# EAGLE design CarteCapteur2 (EAGLE 5.00)
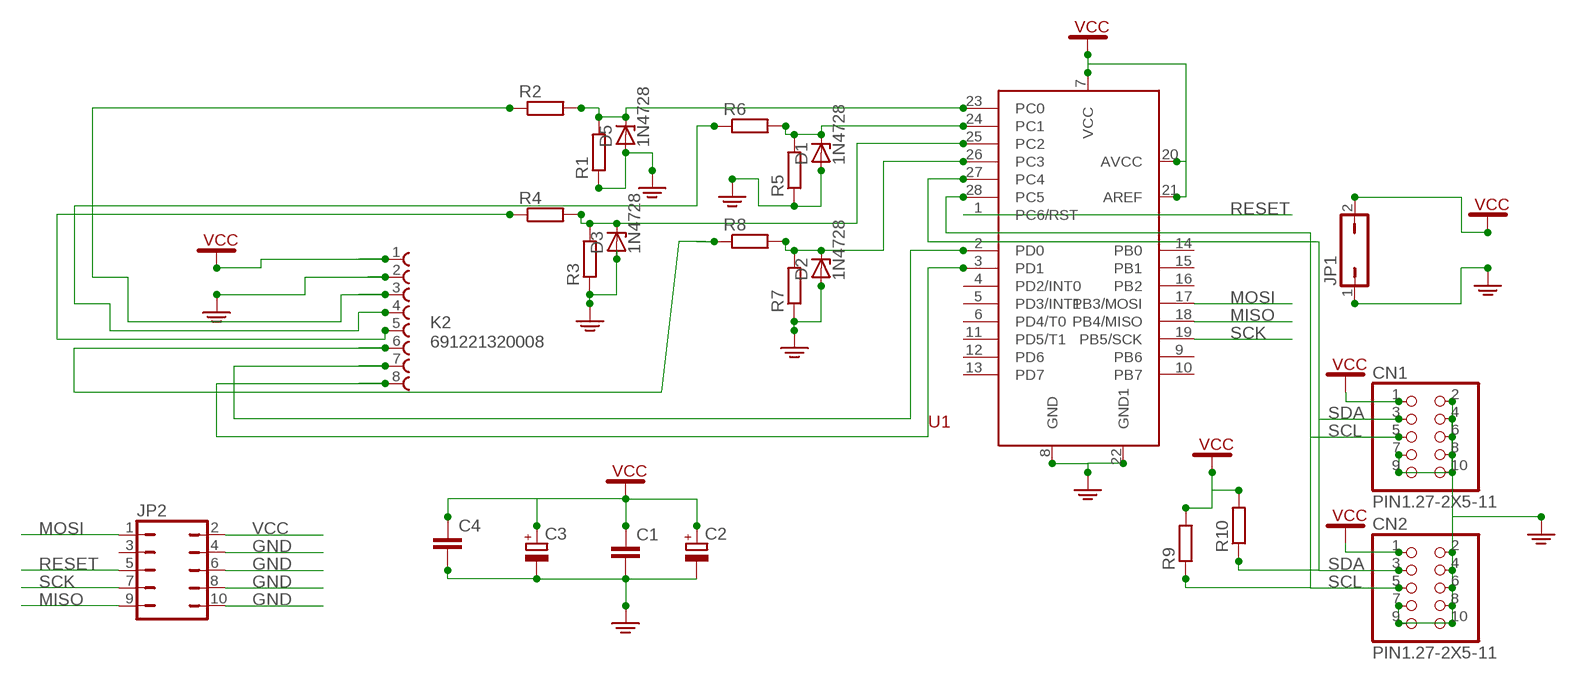
[diagram p0: schematic, sheet 1]

## Parts
C1  C-EU050-025X075  [C050-025X075]
C2  CPOL-EUE5-6  [E5-6]
C3  CPOL-EUE5-6  [E5-6]
C4  C-EU050-025X075  [C050-025X075]
CN1  PIN1.27-2X5-11  [2X05-TH1.27MM-LC]
CN2  PIN1.27-2X5-11  [2X05-TH1.27MM-LC]
D1  1N4728  [DO41Z10]
D2  1N4728  [DO41Z10]
D3  1N4728  [DO41Z10]
D5  1N4728  [DO41Z10]
JP1  JP1Q  [JP1]
JP2  JP5Q  [JP5Q]
K2  691221320008  [691221320008]
R1  R-EU_0207/10  [0207/10]
R2  R-EU_0207/10  [0207/10]
R3  R-EU_0207/10  [0207/10]
R4  R-EU_0207/10  [0207/10]
R5  R-EU_0207/10  [0207/10]
R6  R-EU_0207/10  [0207/10]
R7  R-EU_0207/10  [0207/10]
R8  R-EU_0207/10  [0207/10]
R9  R-EU_0207/10  [0207/10]
R10  R-EU_0207/10  [0207/10]
U1  ATMEGA88  [AT28DIP]

## Nets
GND: C1.2 C2.- C3.- C4.2 CN1.2 CN1.4 CN1.6 CN1.7 CN1.8 CN1.9 CN1.10 CN2.2 CN2.4 CN2.6 CN2.7 CN2.8 CN2.9 CN2.10 D1.A D2.A D3.A D5.A JP1.1 JP2.4 JP2.6 JP2.8 JP2.10 K2.2 R1.1 R3.1 R5.1 R7.1 U1.8(GND) U1.22(GND1)
MISO: JP2.9 U1.18(PB4/MISO)
MOSI: JP2.1 U1.17(PB3/MOSI)
N$1: D5.C R1.2 R2.2 U1.23(PC0)
N$2: D1.C R5.2 R6.2 U1.24(PC1)
N$3: D3.C R3.2 R4.2 U1.25(PC2)
N$4: D2.C R7.2 R8.2 U1.26(PC3)
N$5: K2.3 R2.1
N$6: K2.4 R6.1
N$7: K2.5 R4.1
N$8: K2.6 R8.1
RESET: JP2.5 U1.1(PC6/RST)
RXD: K2.7 U1.2(PD0)
SCK: JP2.7 U1.19(PB5/SCK)
SCL: CN1.5 CN2.5 R9.1 U1.28(PC5)
SDA: CN1.3 CN2.3 R10.1 U1.27(PC4)
TXD: K2.8 U1.3(PD1)
VCC: C1.1 C2.+ C3.+ C4.1 CN1.1 CN2.1 JP1.2 JP2.2 K2.1 R9.2 R10.2 U1.7(VCC) U1.20(AVCC) U1.21(AREF)
Unconnected: JP2.3 U1.4(PD2/INT0) U1.5(PD3/INT1) U1.6(PD4/T0) U1.9(PB6) U1.10(PB7) U1.11(PD5/T1) U1.12(PD6) U1.13(PD7) U1.14(PB0) U1.15(PB1) U1.16(PB2)

## Library data of the parts
C1 C4 = rcl:C-EU: CAPACITOR, European symbol
C2 C3 = rcl:CPOL-EU: POLARIZED CAPACITOR, European symbol
CN1 CN2 = foxboard:PIN1.27-2X5-: HARWIN Female-to-Male IDC Ribbon Cable Assembly 1.27mm Pitch DIL 10 Contacts, 2 rows
D1-D3 D5 = diode:1N4728: Z DIODE 3.3 V, 1W, 5 percent
JP1 = jumper:JP1Q: JUMPER
JP2 = jumper:JP5Q: JUMPER
K2 = Wuerth_Elektronik_eiCan_14_Terminal_Blocks_WR-TBL_2_0:691221320008: WR-TBL Serie 2213 - 3.81mm 45° Entry Modular with Rising Cage Clamp - 1.3mm2 Wires, 8 Pins
R1-R10 = rcl:R-EU_: RESISTOR, European symbol
U1 = ATMELµC:ATMEGA88

## Board
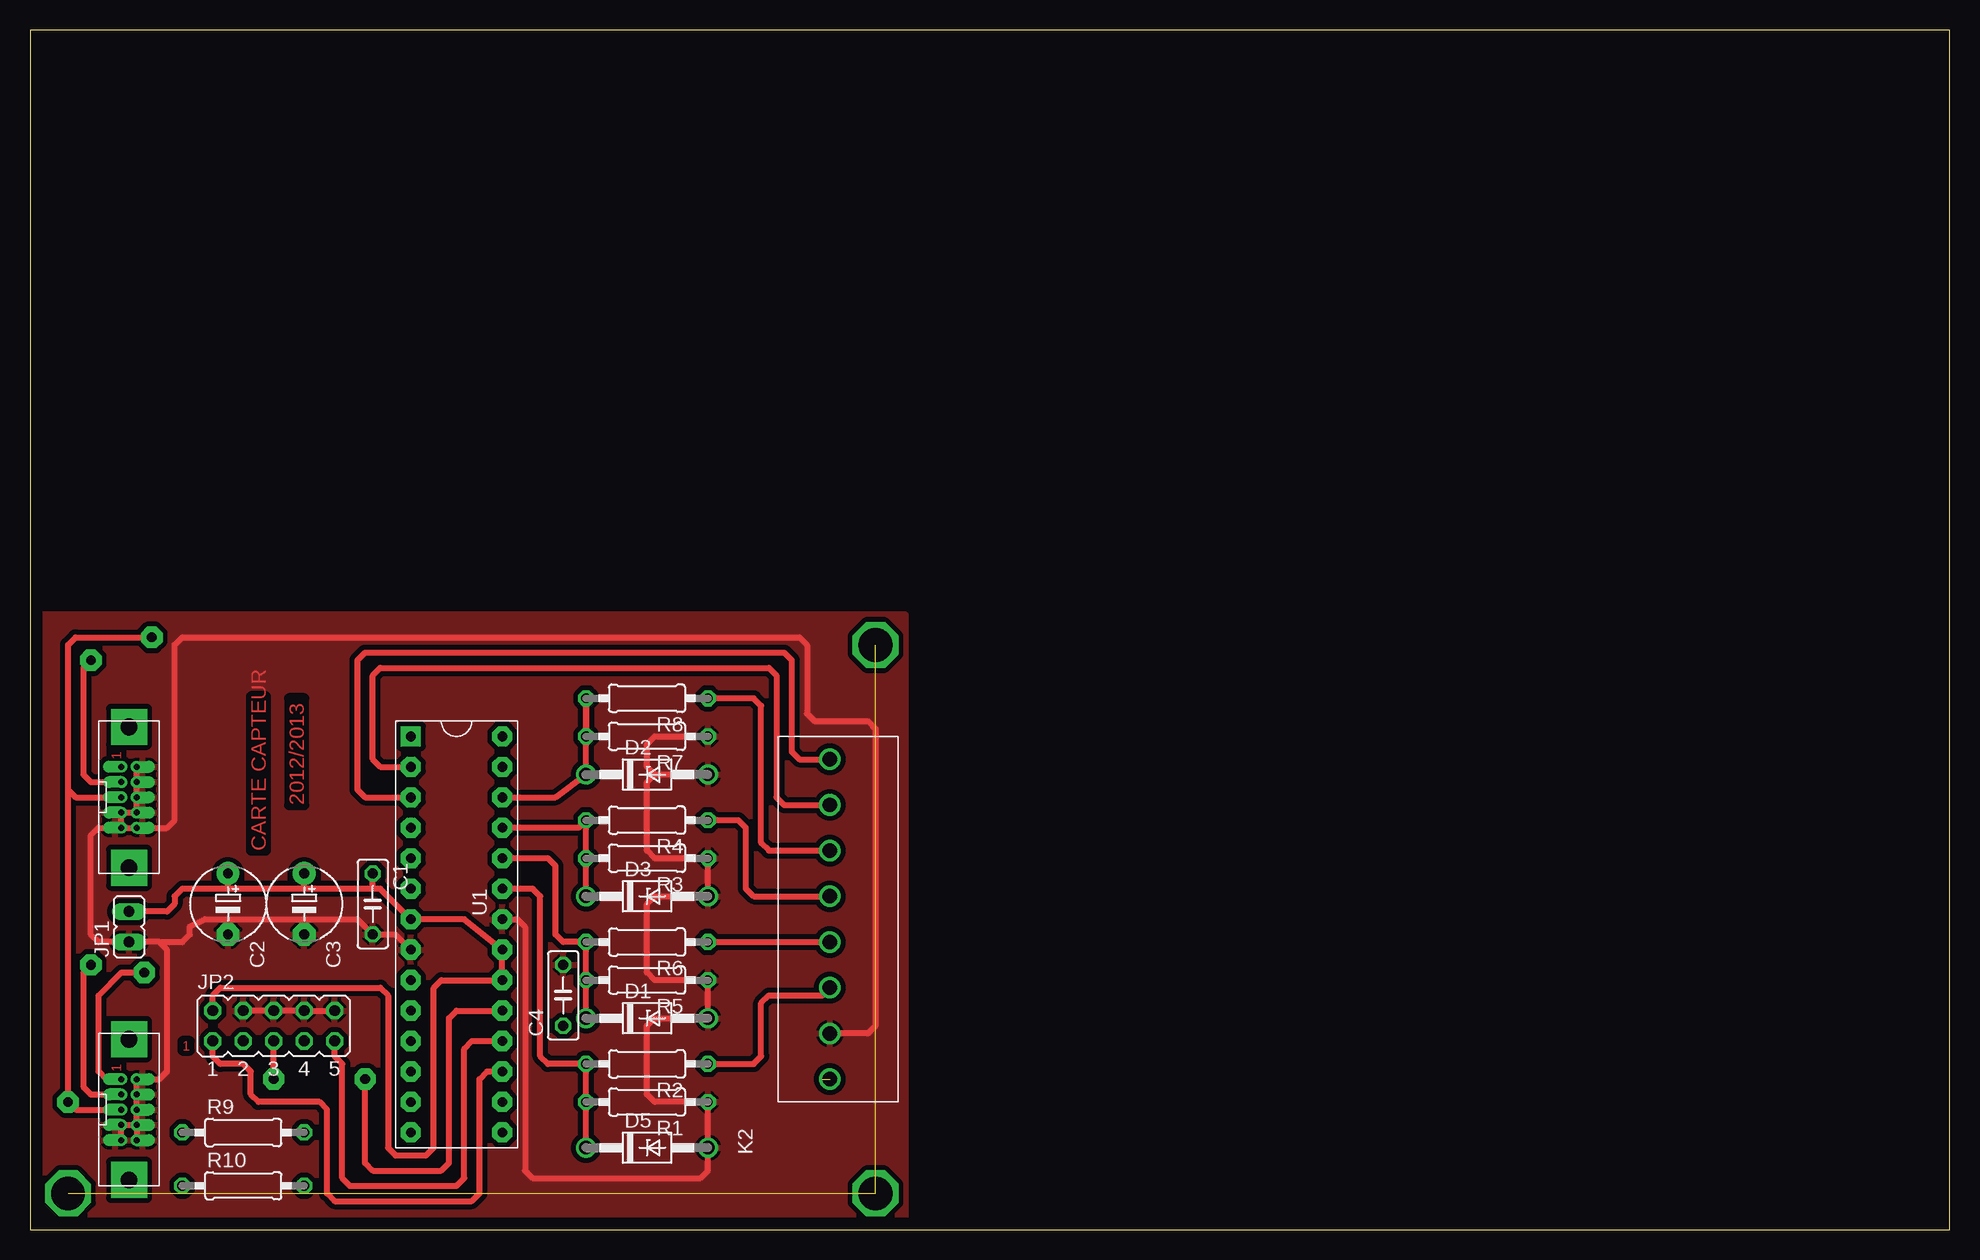
[diagram p1: board, top side]
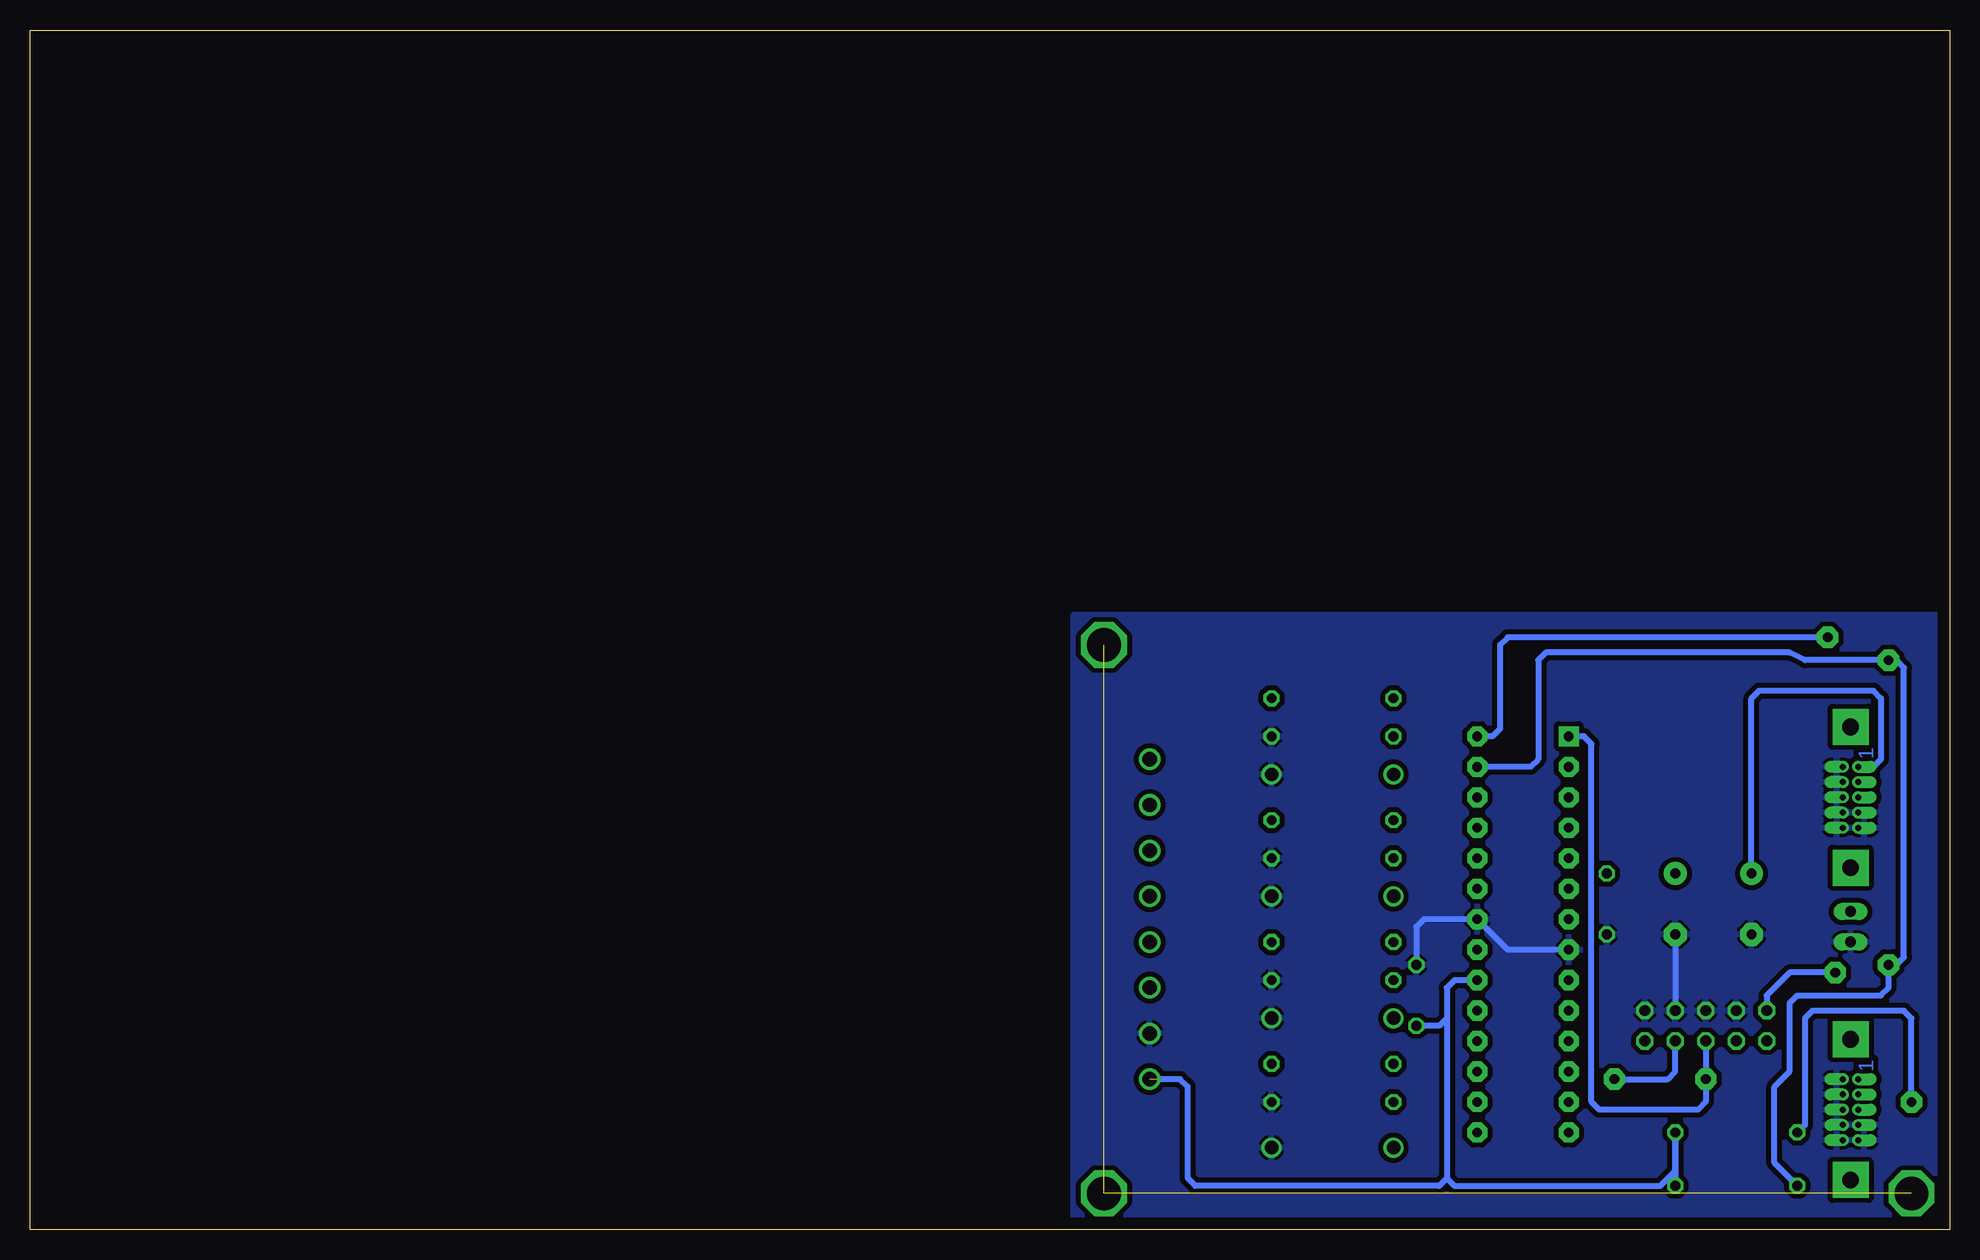
[diagram p2: board, bottom side, seen from below]

Size 160 x 100 mm. Coordinates in mm from the lower left corner, seen from the top.
Outline: 0,0 160,0 160,100 0,100 0,0
Copper layers (1*16): Top 0.035mm / dielectric 1.5mm / Bottom 0.035mm
Design rules "default": minimum track width 10mil, minimum drill 24mil, track to track 8mil, track to pad 8mil, pad to pad 8mil, via to via 8mil, smd to smd 8mil, copper to edge 40mil, drill to drill 8mil, minimum pad ring 10mil, minimum via ring 8mil, stop-mask expansion 4mil, vias tented up to drill 0mil, thermal gap 10mil

### Footprints (pad centres in the part's own frame; a part is rotated, then mirrored left to right if it is on the bottom)
C050-025X075 = drill 0.813 octagon: 1 -2.54,0; 2 2.54,0
E5-6 = drill 0.813 pad 1.905 round: + -2.54,0 | drill 0.813 pad 1.905 octagon: - 2.54,0
2X05-TH1.27MM-LC = drill 0.5 pad 1.016 offset: 1 -2.54,-0.635; 2 -2.54,0.635; 3 -1.27,-0.635; 4 -1.27,0.635; 5 0,-0.635; 6 0,0.635; 7 1.27,-0.635; 8 1.27,0.635; 9 2.54,-0.635; 10 2.54,0.635 | drill 1.4 pad 3 square: P$11 -5.867,0; P$12 5.867,0
DO41Z10 = drill 1.118 round: A 5.08,0; C -5.08,0
JP1 = drill 0.914 long: 1 0,-1.27; 2 0,1.27
JP5Q = drill 0.914 octagon: 1 -5.08,-1.27; 2 -5.08,1.27; 3 -2.54,-1.27; 4 -2.54,1.27; 5 0,-1.27; 6 0,1.27; 7 2.54,-1.27; 8 2.54,1.27; 9 5.08,-1.27; 10 5.08,1.27
691221320008 = drill 1.2 round: 1 -3.81,0; 2 0,0; 3 3.81,0; 4 7.62,0; 5 11.43,0; 6 15.24,0; 7 19.05,0; 8 22.86,0
0207/10 = drill 0.813 octagon: 1 -5.08,0; 2 5.08,0
AT28DIP = drill 0.813 pad 1.676 square: 1 0,0 | drill 0.813 pad 1.676 octagon: 2 2.54,0; 3 5.08,0; 4 7.62,0; 5 10.16,0; 6 12.7,0; 7 15.24,0; 8 17.78,0; 9 20.32,0; 10 22.86,0; 11 25.4,0; 12 27.94,0; 13 30.48,0; 14 33.02,0; 15 33.02,7.62; 16 30.48,7.62; 17 27.94,7.62; 18 25.4,7.62; 19 22.86,7.62; 20 20.32,7.62; 21 17.78,7.62; 22 15.24,7.62; 23 12.7,7.62; 24 10.16,7.62; 25 7.62,7.62; 26 5.08,7.62; 27 2.54,7.62; 28 0,7.62

### Placement (x,y rotation side)
C1  28.57,27.14 270 top
C2  16.5,27.14 270 top
C3  22.86,27.14 270 top
C4  44.45,19.52 90 top
CN1  8.25,10 270 top
CN2  8.25,36.03 270 top
D1  51.43,17.61 0 top
D2  51.43,37.94 0 top
D3  51.43,27.77 0 top
D5  51.43,6.82 0 top
JP1  8.25,25.23 0 top
JP2  20.31,16.98 0 top
K2  66.67,16.34 90 top
R1  51.43,10.63 180 top
R2  51.43,13.81 180 top
R3  51.43,30.95 180 top
R4  51.43,34.12 180 top
R5  51.43,20.79 180 top
R6  51.43,23.96 180 top
R7  51.43,41.11 180 top
R8  51.43,44.28 180 top
R9  17.77,8.09 0 top
R10  17.77,3.64 0 top
U1  31.74,41.11 270 top

### Tracks (layer width: path | path; a pad name or v marks a point on that pad's centre or on a via)
GND
  Top 0.508: R7.1 52.07,41.11 51.43,40.48 51.43,38.57 52.07,37.94 | 57.15,37.94 D2.A 52.07,37.94 | 52.07,37.94 51.43,37.3 51.43,31.58 52.07,30.95 R3.1 D3.A 52.07,27.77 51.43,27.14 51.43,21.42 52.07,20.79 R5.1 D1.A 52.07,17.61 51.43,16.98 51.43,11.27 52.07,10.63 R1.1 D5.A 56.51,4.92 55.88,4.28 41.91,4.28 41.27,4.92 41.27,25.23 40.64,25.87 U1.22 | 10.79,23.96 12.7,23.96 13.33,24.6 13.33,25.23 14.6,25.87 16.5,25.87 | 16.5,25.87 22.86,25.87 | 10.79,23.96 JP1.1 5.71,23.96 5.08,24.6 5.08,32.85 5.71,33.49 CN2.9 | CN2.2 CN2.4 CN2.6 CN2.8 CN2.7 CN2.9 | CN2.9 CN2.10 11.43,33.49 12.06,34.12 12.06,48.73 12.7,49.37 64.13,49.37 64.77,48.73 64.77,43.02 65.4,42.38 69.84,42.38 70.48,41.74 70.48,16.98 69.84,16.34 67.3,16.34 | CN1.8 CN1.10 | CN1.8 CN1.6 CN1.4 CN1.2 10.79,12.54 11.43,13.17 11.43,23.33 10.79,23.96 | CN1.9 CN1.7 CN1.8 | 16.5,25.87 C2.- | 22.86,25.87 C3.- | U1.8 30.47,24.6 C1.2 27.3,25.87 22.86,25.87 | JP2.10 JP2.8 JP2.6 JP2.4
  Bottom 0.508: U1.8 36.83,23.33 U1.22 43.81,25.87 44.45,25.23 C4.2 | C3.- JP2.8
  pour Bottom (isolate 0.406): 0.63,0.47 73.02,0.47 73.02,51.27 0.63,51.27
  pour Top (isolate 0.406): 0.63,0.47 73.02,0.47 73.02,51.27 0.63,51.27
MISO
  Top 0.508: U1.18 36.83,15.71 36.19,15.08 36.19,4.28 35.55,3.64 26.66,3.64 26.03,4.28 26.03,13.81 25.39,14.44 JP2.9
MOSI
  Top 0.508: U1.17 38.1,13.17 37.46,12.54 37.46,3.01 36.83,2.38 25.39,2.38 24.76,3.01 24.76,10 24.12,10.63 19.04,10.63 18.41,11.27 18.41,13.17 17.77,13.81 15.87,13.81 15.24,14.44 JP2.1
N$1
  Top 0.508: U1.23 41.91,28.41 42.54,27.77 42.54,14.44 43.18,13.81 R2.2 R1.2 D5.C
N$2
  Top 0.508: U1.24 43.18,30.95 43.81,30.31 43.81,24.6 44.45,23.96 R6.2 R5.2 | R5.2 46.35,20.15 | D1.C R5.2
N$3
  Top 0.508: U1.25 45.72,33.49 R4.2 R3.2 D3.C
N$4
  Top 0.508: U1.26 43.81,36.03 D2.C R8.2 R7.2
N$5
  Top 0.508: R2.1 60.32,13.81 60.96,14.44 60.96,18.88 61.59,19.52 66.03,19.52 K2.3
N$6
  Top 0.508: R6.1 K2.4
N$7
  Top 0.508: R4.1 59.05,34.12 59.69,33.49 59.69,28.41 60.32,27.77 K2.5
N$8
  Top 0.508: R8.1 60.32,44.28 60.96,43.65 60.96,32.22 61.59,31.58 K2.6
N$20  (via drill 2.8 pad 1.78)  (2 unrouted)
  other vias: 3.17,3.01 70.48,3.01 70.48,48.73
RESET  (via drill 0.81 pad 1.78)
  Top 0.508: v20.31,12.54 JP2.5
  Bottom 0.508: JP2.5 20.31,10.63 20.95,10 29.2,10 29.84,10.63 29.84,40.48 30.47,41.11 U1.1
RXD
  Top 0.508: U1.2 29.2,38.57 28.57,39.2 28.57,46.19 29.2,46.82 61.59,46.82 62.23,46.19 62.23,36.03 62.86,35.39 K2.7
SCK  (via drill 0.81 pad 1.78)
  Top 0.508: U1.19 35.55,18.25 34.92,17.61 34.92,5.55 34.29,4.92 28.57,4.92 27.93,5.55 v27.93,12.54
  Bottom 0.508: v27.93,12.54 23.49,12.54 22.86,13.17 JP2.7
SCL  (via drill 0.81 pad 1.78)
  Top 0.508: v10.16,49.37 3.8,49.37 3.17,48.73 3.17,36.66 | 3.17,36.66 3.8,36.03 CN2.5 | CN1.5 3.8,10 v3.17,10.63 3.17,36.66
  Bottom 0.508: R9.1 12.06,8.73 12.06,17.61 11.43,18.25 3.8,18.25 3.17,17.61 v3.17,10.63 | v10.16,49.37 36.83,49.37 37.46,48.73 37.46,41.74 38.1,41.11 U1.28
SDA  (via drill 0.81 pad 1.78)
  Top 0.508: v5.08,47.46 4.44,46.82 4.44,37.94 5.08,37.3 CN2.3 | CN1.3 5.08,11.27 4.44,11.9 4.44,21.42 v5.08,22.06
  Bottom 0.508: R10.1 14.6,5.55 14.6,11.9 13.33,13.17 13.33,18.88 12.7,19.52 5.71,19.52 5.08,20.15 v5.08,22.06 4.44,22.06 3.8,22.7 3.8,46.82 4.44,47.46 v5.08,47.46 12.06,47.46 13.33,48.09 33.65,48.09 34.29,47.46 34.29,39.2 34.92,38.57 U1.27
TXD
  Top 0.508: U1.3 27.93,36.03 27.3,36.66 27.3,47.46 27.93,48.09 62.86,48.09 63.5,47.46 63.5,39.84 64.13,39.2 K2.8
VCC  (via drill 0.81 pad 1.78)  (1 unrouted)
  Top 0.508: JP1.2 11.43,26.5 12.06,27.14 12.06,27.77 12.7,28.41 16.5,28.41 | 22.86,28.41 16.5,28.41 | CN2.1 6.34,38.57 | CN1.1 6.34,12.54 5.71,13.17 5.71,19.52 7.62,21.42 v9.52,21.42 | 16.5,28.41 C2.+ | 22.86,28.41 C3.+ | JP2.2 15.24,19.52 15.87,20.15 29.2,20.15 29.84,19.52 29.84,6.82 30.47,6.18 33.02,6.18 33.65,6.82 33.65,20.15 34.29,20.79 U1.20 U1.21 36.19,25.87 U1.7 29.2,28.41 28.57,28.41 | 28.57,28.41 C1.1 | 28.57,28.41 22.86,28.41
  Bottom 0.508: 41.91,4.28 42.54,3.64 62.86,3.64 63.5,4.28 63.5,11.9 64.13,12.54 66.03,12.54 66.67,13.17 | 41.91,17.61 41.91,20.15 41.27,20.79 U1.20 | 41.91,17.61 41.91,4.28 | R10.2 R9.2 22.86,4.92 24.12,3.64 41.27,3.64 41.91,4.28 | v9.52,21.42 13.33,21.42 15.24,19.52 JP2.2 | C4.1 42.54,16.98 41.91,17.61 | CN2.1 6.34,38.57 5.71,39.2 5.71,44.28 6.34,44.92 15.87,44.92 16.5,44.28 C2.+

### Text on the board
Top: 1 | 2012/2013 | CARTE CAPTEUR | 1 | 1